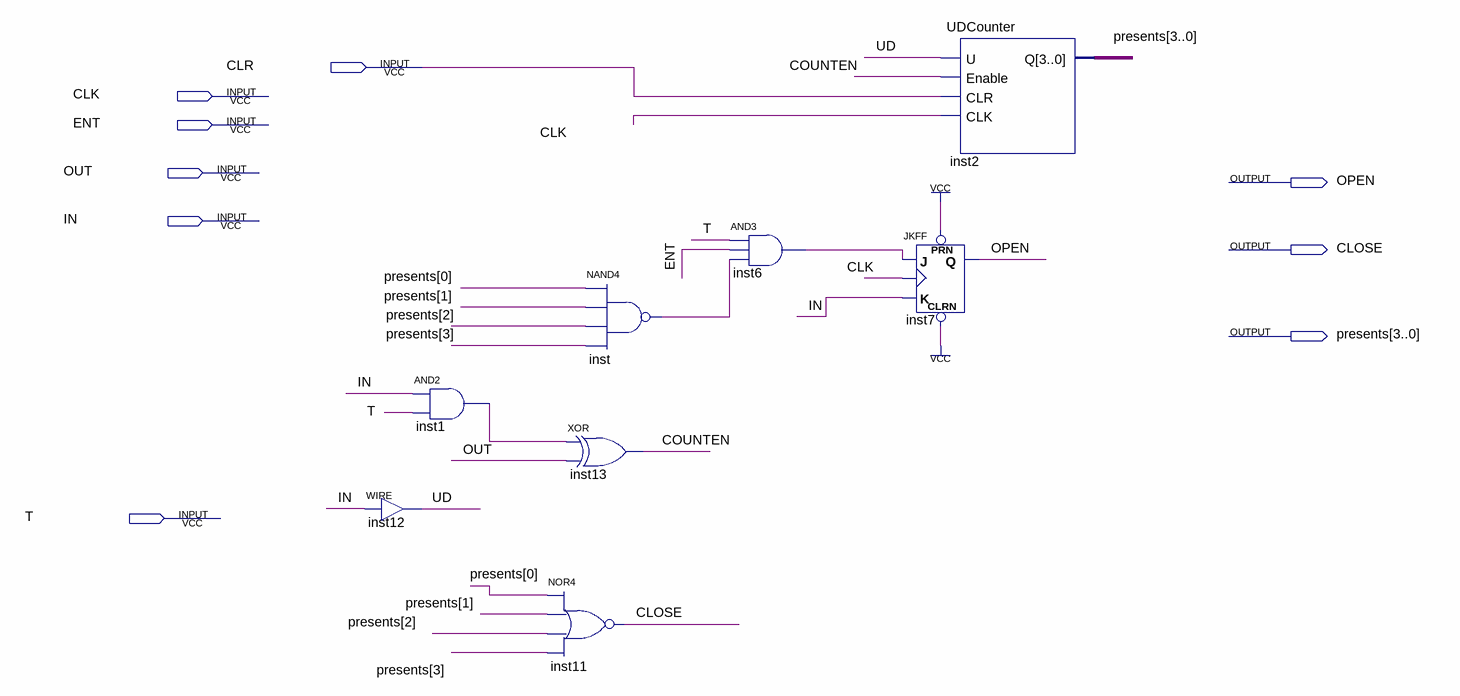
[diagram p0: schematic sheet]
// Quartus schematic watingRoom.bdf as structural Verilog: 8 symbols, 9 pins
module watingRoom (
  input  CLR,
  input  CLK,
  input  ENT,
  input  OUT,
  input  IN,
  input  T,
  output OPEN,
  output CLOSE,
  output [3:0] presents
);

  wire COUNTEN, inst1_out, inst6_out, inst_out, UD;

  assign UD = IN;  // WIRE inst12
  and inst1 (inst1_out, IN, T);
  nand inst (inst_out, presents[0], presents[1], presents[2], presents[3]);
  xor inst13 (COUNTEN, inst1_out, OUT);
  nor inst11 (CLOSE, presents[0], presents[1], presents[2], presents[3]);
  and inst6 (inst6_out, T, ENT, inst_out);
  JKFF inst7 (.PRN(1'b1), .CLRN(1'b1), .K(IN), .J(inst6_out), .CLK(CLK), .Q(OPEN));
  UDCounter inst2 (.U(UD), .Enable(COUNTEN), .CLR(CLR), .CLK(CLK), .Q(presents));
endmodule
